# Altium schematic sheet DIGITAL_OUTPUT_2CH.SchDoc
size A4
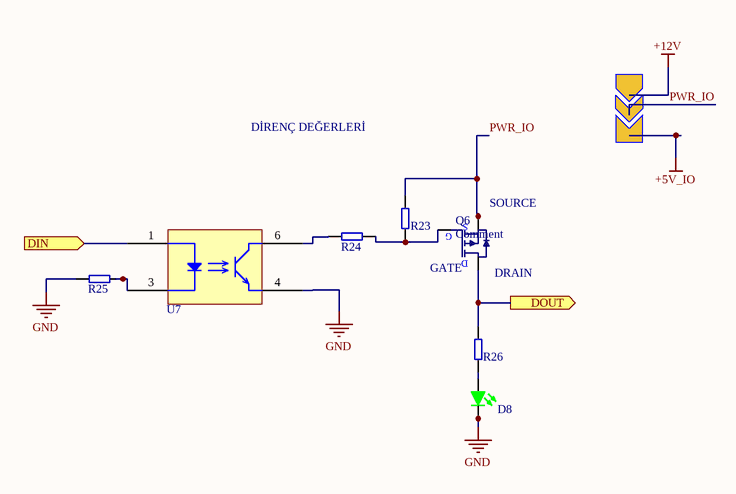
[diagram p0: DIGITAL_OUTPUT_2CH.SchDoc]

## Parts
D8  SML-LX0603GW-TR  [L0603]  (value not drawn)
JMP2  Jumper  [SB0402_3PAD]  (value not drawn)
Q6  Comment  [SOT-23-3]
R23  1K  [R0402]  (value not drawn)
R24  1K  [R0402]  (value not drawn)
R25  1K  [R0402]  (value not drawn)
R26  4.7K  [R0402]  (value not drawn)
U7  TLP183(BLL-TPL,E  [TLP183(BLL-TPL,E]  (value not drawn)

## Ports
DIN (in), DOUT (out)

## Nets
+5V_IO: JMP2.3
+12V: JMP2.1
GND: D8.C R25.1 U7.4(Emi)
DIN: U7.1(A) ; port DIN
DOUT: Q6.3(D) R26.2 ; port DOUT
PWR_IO: JMP2.2 Q6.2(S) R23.1
NetD8_A: D8.A R26.1
NetQ6_1: Q6.1(G) R23.2 R24.2
NetR24_1: R24.1 U7.6(Col)
NetR25_2: R25.2 U7.3(C)

## Notes on the sheet
- DİRENÇ DEĞERLERİ
- (near Q6) SOURCE
- (near Q6) GATE
- (near Q6) DRAIN

## Library data of the parts
D8 = SML-LX0603GW-TR: LED GREEN DIFFUSED SMD; Manufacturer: Lumex Opto/Components Inc.; Que: 001; Forward Voltage: 2.2V; Current: 20mA; Name: Recep Aydin; Part Number: SML-LX0603GW-TR; LensTransparency: Diffused; Color: Green; Package: 0603(1608 Metric); Datasheet: https://www.lumex.com/datasheet/SML-LX0603GW-TR; Manufacturer Part Number: SML-LX0603GW-TR
JMP2 = Solder Bridge0402_3pad: 0402 Solder Bridge 3 PAD; Que: 008; Name: Recep Aydin; Part Number: Solder Bridge0402_3pad
Q6 = RU20P7C: 20V 5A 28mΩ@4.5V,5A 1.3W 1.1V@250μA P Channel; Que: 009; Part Number: RU20P7C; Type: PMOS; Package: SOT-23-3; Datasheet: https://datasheet.lcsc.com/szlcsc/2008251903_Shenzhen-ruichips-Semicon-RU20P7C_C181984.pdf
R23-R25 = RT0402BRE071KL: RES SMD 1K OHM 0.1% 1/16W 0402; Manufacturer: Yageo; Que: 015; Name: Recep Aydin; Part Number: RT0402BRE071KL; Tolerance: 0.1%; Resistor Type: Thick Film; Package: 0402; Datasheet: https://www.yageo.com/upload/media/product/productsearch/datasheet/rchip/PYu-RT_1-to-0.01_RoHS_L_12.pdf; Manufacturer Part Number: RT0402BRE071KL
R26 = CRCW04024K70FKED: RES SMD 4.7K OHM 1% 1/16W 0402; Manufacturer: Vishay Dale; Que: 017; Tolerance: 0.1%; Name: Recep Aydin; Part Number: CRCW04024K70FKED; Resistor Type: Thick Film; Package: 0402; Datasheet: https://www.vishay.com/docs/20035/dcrcwe3.pdf; Manufacturer Part Number: CRCW04024K70FKED
U7 = TLP183(BLL-TPL,E: OPTOISO 3.75KV TRANS 6-SO 4 LEAD; Manufacturer: Toshiba; Que: 003; NumberofChannels: 1; Voltage-Isolation: 3750Vrms; Output Type: Transistor; Output Current: 50mA; Forward Voltage: 1.25V; Name: Recep Aydin; Part Number: TLP183(BLL-TPL,E; Current DC Forward: 50mA; Package: 6-SOIC; Datasheet: https://www.digikey.com/en/products/detail/toshiba-semiconductor-and-storage/TLP183-BLL-TPL-E/4562835; Manufacturer Part Number: TLP183(BLL-TPL,E